# Altium schematic sheet ECSE_Comp.SchDoc
size A4; SheetNumber: 1; SheetTotal: 1
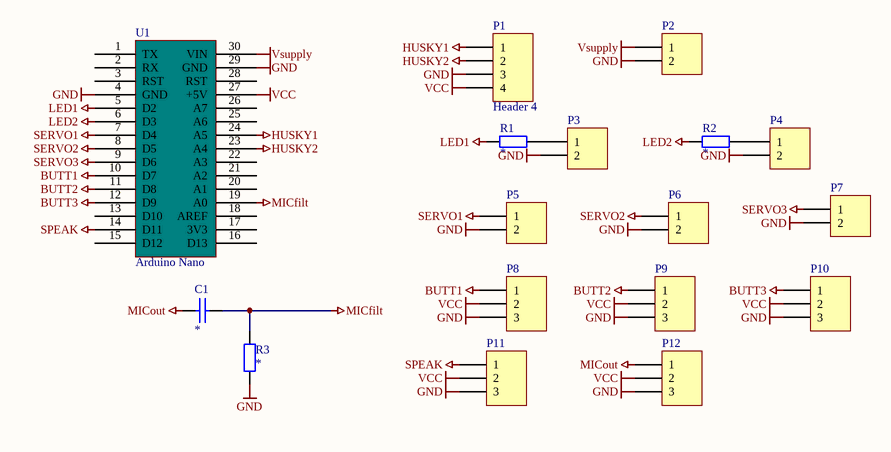
[diagram p0: ECSE_Comp.SchDoc]

## Parts
C1  *  [CCAP-5P0]
P1  Header 4  [ece-HDR1X4]
P2  Header 2  [ece-HDR1X2]  (value not drawn)
P3  Header 2  [ece-HDR1X2]  (value not drawn)
P4  Header 2  [ece-HDR1X2]  (value not drawn)
P5  Header 2  [ece-HDR1X2]  (value not drawn)
P6  Header 2  [ece-HDR1X2]  (value not drawn)
P7  Header 2  [ece-HDR1X2]  (value not drawn)
P8  Header 3  [ece-HDR1X3]  (value not drawn)
P9  Header 3  [ece-HDR1X3]  (value not drawn)
P10  Header 3  [ece-HDR1X3]  (value not drawn)
P11  Header 3  [ece-HDR1X3]  (value not drawn)
P12  Header 3  [ece-HDR1X3]  (value not drawn)
R1  *  [AXIAL-0.4]
R2  *  [AXIAL-0.4]
R3  *  [AXIAL-0.4]
U1  Arduino Nano  [PCBComponent_1]

## Nets
BUTT1: P8.1 U1.10(D7)
BUTT2: P9.1 U1.11(D8)
BUTT3: P10.1 U1.12(D9)
GND: P1.3 P2.2 P3.2 P4.2 P5.2 P6.2 P7.2 P8.3 P9.3 P10.3 P11.3 P12.3 R3.1 U1.4(GND) U1.29(GND)
HUSKY1: P1.1 U1.24(A5)
HUSKY2: P1.2 U1.23(A4)
LED1: R1.1 U1.5(D2)
LED2: R2.1 U1.6(D3)
MICfilt: C1.2 R3.2 U1.19(A0)
MICout: C1.1 P12.1
SERVO1: P5.1 U1.7(D4)
SERVO2: P6.1 U1.8(D5)
SERVO3: P7.1 U1.9(D6)
SPEAK: P11.1 U1.14(D11)
VCC: P1.4 P8.2 P9.2 P10.2 P11.2 P12.2 U1.27(+5V)
Vsupply: P2.1 U1.30(VIN)
NetP3_1: P3.1 R1.2
NetP4_1: P4.1 R2.2

Not connected (* = marked no-connect by the designer): U1 1(TX) 2(RX) 3(RST) 13(D10) 15(D12) 16(D13) 17(3V3) 18(AREF) 20(A1) 21(A2) 22(A3) 25(A6) 26(A7) 28(RST)

## Library data of the parts
C1 = CerCap_TH_5P0: TH ceramic capacitor with 5mm pitch; Value: *
P1 = Header 4: Header, 4-Pin; LatestRevisionDate: 17-Jul-2002; LatestRevisionNote: Re-released for DXP Platform.; Publisher: Altium Limited
P2-P7 = Header 2: Header, 2-Pin; LatestRevisionDate: 17-Jul-2002; LatestRevisionNote: Re-released for DXP Platform.; Publisher: Altium Limited
P8-P12 = Header 3: Header, 3-Pin; LatestRevisionDate: 17-Jul-2002; LatestRevisionNote: Re-released for DXP Platform.; Publisher: Altium Limited
R1-R3 = Res_TH_0AX4: Through hole resistor; Published: 8-Jun-2000; LatestRevisionDate: 17-Jul-2002; LatestRevisionNote: Re-released for DXP Platform.; PackageReference: AXIAL-0.4; Publisher: Altium Limited; Value: *; ComponentLink1Description: http://www.royalohm.com/pdf/product2017/PrecisionMetalMF.pdf
U1 = Component_1